# EAGLE board zx80 SD_12 (smd) build006.4 (STM32) (EAGLE 9.6.2), part 1 of 2
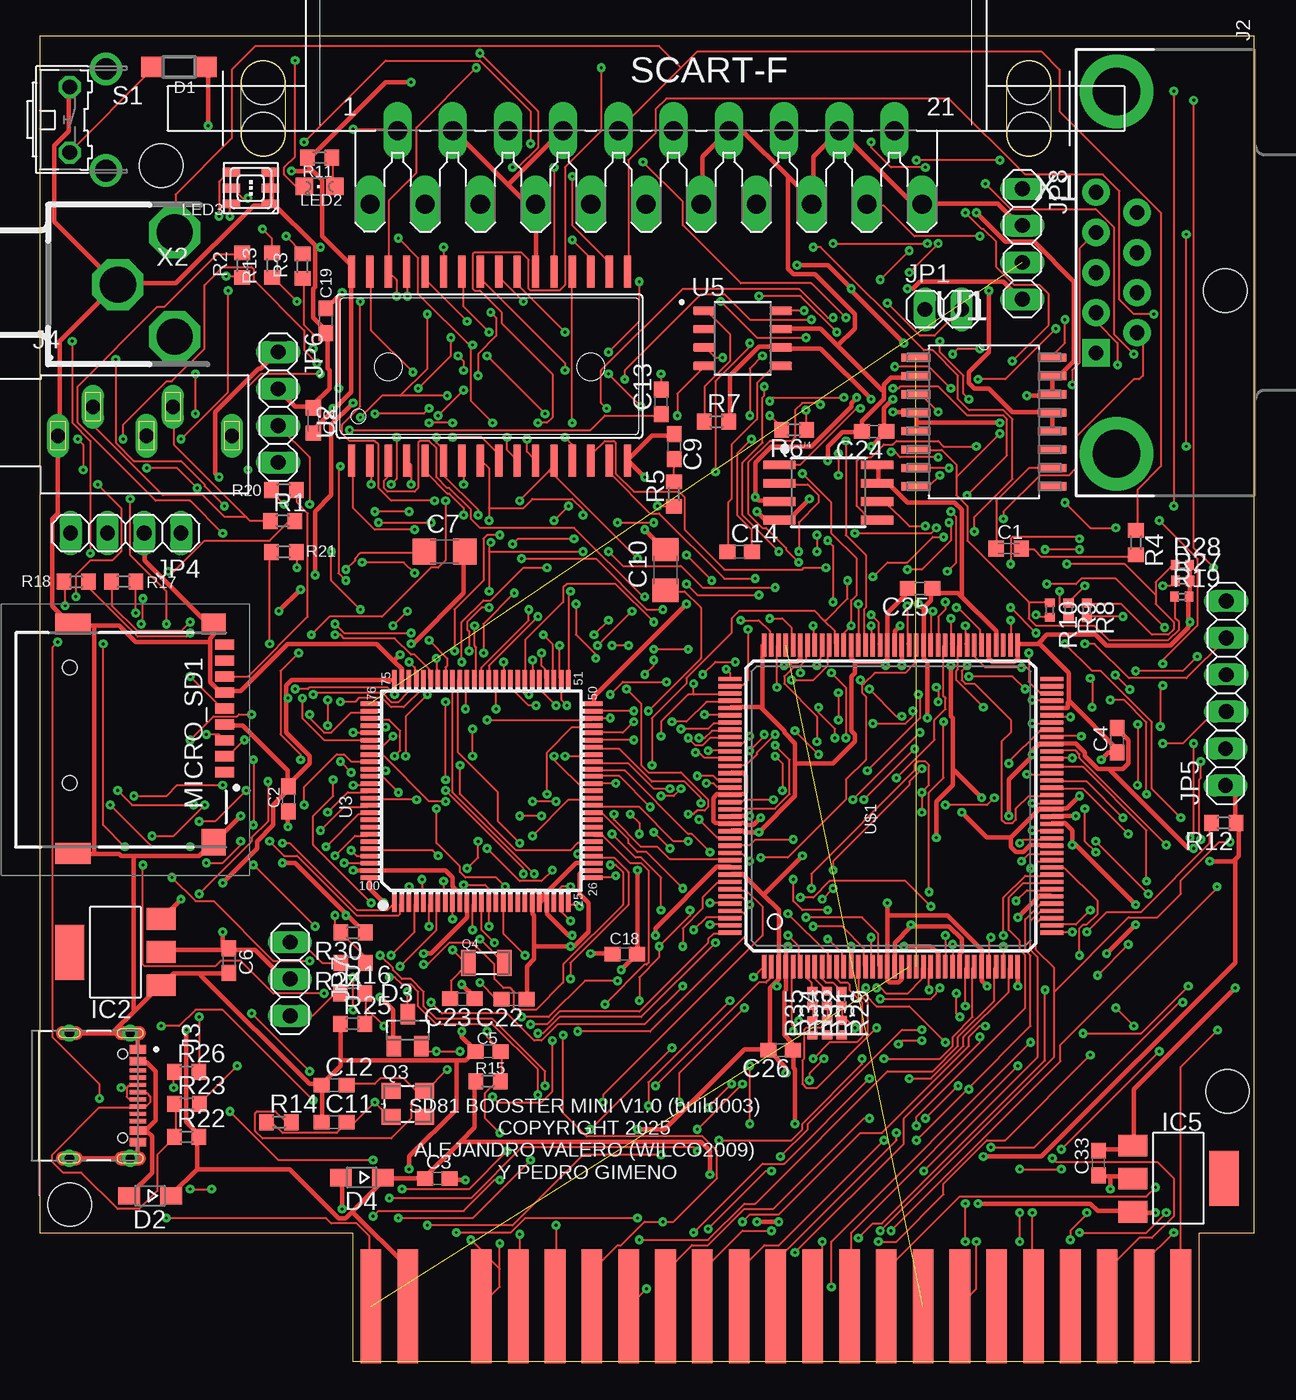
[diagram p3: board, top side]
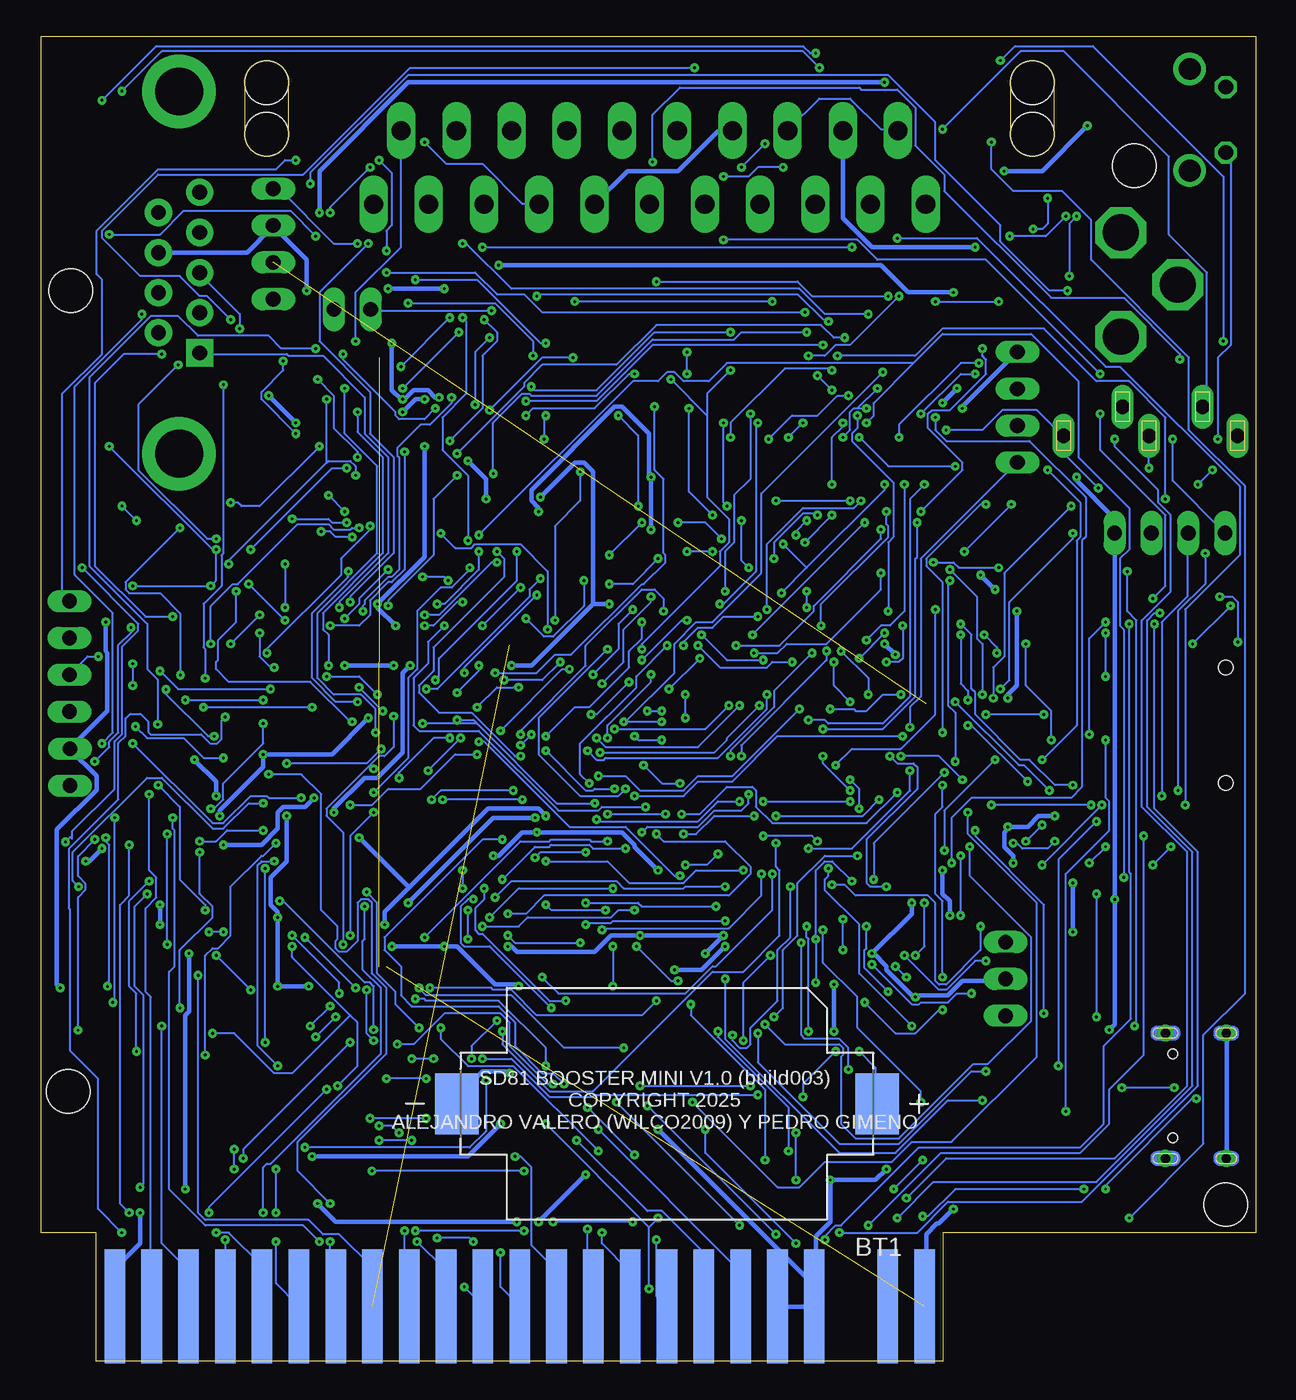
[diagram p4: board, bottom side, seen from below]

Size 83.82 x 91.44 mm. Coordinates in mm from the lower left corner, seen from the top.
Outline: 80.01,8.89 83.82,8.89 83.82,91.44 0,91.44 0,8.89 21.59,8.89 21.59,0 80.01,0 80.01,8.89
Copper layers (1*16): Top 0.035mm / dielectric 1.5mm / Bottom 0.035mm
Design rules "default *": minimum track width 5mil, minimum drill 0.2mm, track to track 5mil, track to pad 5mil, pad to pad 5mil, via to via 5mil, smd to smd 5mil, copper to edge 20mil, drill to drill 6mil, minimum pad ring 10mil, minimum via ring 8mil, stop-mask expansion 4mil, vias tented up to drill 999mil, thermal gap 10mil
Net classes: 1 VCC: width 0.3 mm; 2 3,3: width 0.3 mm
Holes 3 mm at 2.09,10.82 8.38,82.51 81.79,73.87 81.96,18.64

## Footprints (pad centres in the part's own frame; a part is rotated, then mirrored left to right if it is on the bottom)
EDGEPIN = smd 1.422 x 7.874: 1 0,0
BAT_CR2032-BS-6-1 = smd 3 x 4.2: N 14.5,0; P -14.5,0
C0603K = smd 1.05 x 1.08: 1 -0.875,0; 2 0.875,0
C0603 = smd 1.1 x 1: 1 -0.85,0; 2 0.85,0
C1206 = smd 1.6 x 1.8: 1 -1.4,0; 2 1.4,0
SOD123 = smd 1.4 x 1.4: A 1.9,0; C -1.9,0
SOD323-W = smd 1.5 x 1.2: A 1.45,0; C -1.45,0
SOT23 = smd 1 x 1.4: 1 -0.95,-1.1; 2 0.95,-1.1; 3 0,1.1
SOT223 = smd 1.499 x 2.007: 1 -2.261,-3.15; 2 0.025,-3.15; 3 2.311,-3.15 | smd 3.81 x 2.007: 4 0,3.15
DB9_MALE = drill 1.016 pad 1.88 square: 1 5.54,-1.42 | drill 1.016 pad 1.88: 2 2.77,-1.42; 3 0,-1.42; 4 -2.77,-1.42; 5 -5.54,-1.42; 6 4.15,1.42; 7 1.38,1.42; 8 -1.38,1.42; 9 -4.15,1.42 | drill 3.302 pad 5.08: G1 -12.5,0; G2 12.5,0
SHOUHAN_TYPE-C_16PIN_2MD__073_ = smd 0.6 x 1.14: A1_B12 -3.2,3.675; A4_B9 -2.4,3.675; B1_A12 3.2,3.675; B4_A9 2.4,3.675 | smd 0.3 x 1.14: A5 -1.25,3.675; A6 -0.25,3.675; A7 0.25,3.675; A8 1.25,3.675; B5 1.75,3.675; B6 0.75,3.675; B7 -0.75,3.675; B8 -1.75,3.675 | drill 0.65 pad 0.95: SH1 -4.325,3.125; SH2 4.325,3.125; SH3 -4.325,-1.075; SH4 4.325,-1.075 | hole 0.65: -2.89,2.605; 2.89,2.605
XKB_PJ-325C5-G = drill 1 long: 1 0,-0.9; 2 2.4,1.1; 3 7.92,1.1; 4 12,-0.9; 5 6.1,-0.9
1X02 = drill 1.016 long: 1 -1.27,0; 2 1.27,0
1X04 = drill 1.016 long: 1 -3.81,0; 2 -1.27,0; 3 1.27,0; 4 3.81,0
1X03 = drill 1.016 long: 1 -2.54,0; 2 0,0; 3 2.54,0
CHIPLED_0805 = smd 1.2 x 1.2: A 0,-1.05; C 0,1.05
3535-PLCC6 = smd 1.2 x 0.6: P1 1.35,-1.1; P2 1.35,0; P3 1.35,1.1; P4 -1.35,1.1; P5 -1.35,0; P6 -1.35,-1.1
TF-01A = smd 0.7 x 1.3: 1 2.23,7.174; 2 1.13,7.174; 3 0.03,7.174; 4 -1.07,7.174; 5 -2.17,7.174; 6 -3.27,7.174; 7 -4.37,7.174; 8 -5.47,7.174; CD1 -6.57,7.174 | smd 1.448 x 1.651: MP1 -7.989,6.4 | smd 1.448 x 2.438: MP2 -7.989,-3.3; MP3 7.836,-3.3 | smd 1.854 x 1.651: MP4 7.061,6.4 | hole 1: -5.004,-3.531; 2.972,-3.531
3.2X2.5_KX-7 = smd 1.3 x 1.1: 1 -1.15,-0.9; 2 1.15,-0.9; 3 1.15,0.9; 4 -1.15,0.9
3.2X1.5 = smd 1 x 1.8: 1 -1.25,0; 2 1.25,0
R0603 = smd 1 x 1.1: 1 -0.85,0; 2 0.85,0
R0402 = smd 0.6 x 0.7: 1 -0.5,0; 2 0.5,0
B3F-31XX = drill 1.016 octagon: 1 -2.261,-1.245; 2 2.261,-1.245 | drill 1.499 pad 2.159: 3 -3.505,1.245; 4 3.505,1.245
SOIC127P1032X265-16N = smd 1.981 x 0.559: 1 -4.699,4.445; 2 -4.699,3.175; 3 -4.699,1.905; 4 -4.699,0.635; 5 -4.699,-0.635; 6 -4.699,-1.905; 7 -4.699,-3.175; 8 -4.699,-4.445; 9 4.699,-4.445; 10 4.699,-3.175; 11 4.699,-1.905; 12 4.699,-0.635; 13 4.699,0.635; 14 4.699,1.905; 15 4.699,3.175; 16 4.699,4.445
SOP32-5 = smd 2.2 x 0.5: 1 -6.516,9.525; 2 -6.516,8.255; 3 -6.516,6.985; 4 -6.516,5.715; 5 -6.516,4.445; 6 -6.516,3.175; 7 -6.516,1.905; 8 -6.516,0.635; 9 -6.516,-0.635; 10 -6.516,-1.905; 11 -6.516,-3.175; 12 -6.516,-4.445; 13 -6.516,-5.715; 14 -6.516,-6.985; 15 -6.516,-8.255; 16 -6.516,-9.525; 17 6.516,-9.525; 18 6.516,-8.255; 19 6.516,-6.985; 20 6.516,-5.715; 21 6.516,-4.445; 22 6.516,-3.175; 23 6.516,-1.905; 24 6.516,-0.635; 25 6.516,0.635; 26 6.516,1.905; 27 6.516,3.175; 28 6.516,4.445; 29 6.516,5.715; 30 6.516,6.985; 31 6.516,8.255; 32 6.516,9.525
LQFP100-0.5-13.8X13.8MM = smd 1.2 x 0.32: 1 -7.75,6; 2 -7.75,5.5; 3 -7.75,5; 4 -7.75,4.5; 5 -7.75,4; 6 -7.75,3.5; 7 -7.75,3; 8 -7.75,2.5; 9 -7.75,2; 10 -7.75,1.5; 11 -7.75,1; 12 -7.75,0.5; 13 -7.75,0; 14 -7.75,-0.5; 15 -7.75,-1; 16 -7.75,-1.5; 17 -7.75,-2; 18 -7.75,-2.5; 19 -7.75,-3; 20 -7.75,-3.5; 21 -7.75,-4; 22 -7.75,-4.5; 23 -7.75,-5; 24 -7.75,-5.5; 25 -7.75,-6; 51 7.75,-6; 52 7.75,-5.5; 53 7.75,-5; 54 7.75,-4.5; 55 7.75,-4; 56 7.75,-3.5; 57 7.75,-3; 58 7.75,-2.5; 59 7.75,-2; 60 7.75,-1.5; 61 7.75,-1; 62 7.75,-0.5; 63 7.75,0; 64 7.75,0.5; 65 7.75,1; 66 7.75,1.5; 67 7.75,2; 68 7.75,2.5; 69 7.75,3; 70 7.75,3.5; 71 7.75,4; 72 7.75,4.5; 73 7.75,5; 74 7.75,5.5; 75 7.75,6 | smd 0.32 x 1.2: 26 -6,-7.75; 27 -5.5,-7.75; 28 -5,-7.75; 29 -4.5,-7.75; 30 -4,-7.75; 31 -3.5,-7.75; 32 -3,-7.75; 33 -2.5,-7.75; 34 -2,-7.75; 35 -1.5,-7.75; 36 -1,-7.75; 37 -0.5,-7.75; 38 0,-7.75; 39 0.5,-7.75; 40 1,-7.75; 41 1.5,-7.75; 42 2,-7.75; 43 2.5,-7.75; 44 3,-7.75; 45 3.5,-7.75; 46 4,-7.75; 47 4.5,-7.75; 48 5,-7.75; 49 5.5,-7.75; 50 6,-7.75; 76 6,7.75; 77 5.5,7.75; 78 5,7.75; 79 4.5,7.75; 80 4,7.75; 81 3.5,7.75; 82 3,7.75; 83 2.5,7.75; 84 2,7.75; 85 1.5,7.75; 86 1,7.75; 87 0.5,7.75; 88 0,7.75; 89 -0.5,7.75; 90 -1,7.75; 91 -1.5,7.75; 92 -2,7.75; 93 -2.5,7.75; 94 -3,7.75; 95 -3.5,7.75; 96 -4,7.75; 97 -4.5,7.75; 98 -5,7.75; 99 -5.5,7.75; 100 -6,7.75
SO08-EIAJ = smd 0.61 x 2.21: 1 -1.905,-3.378; 2 -0.635,-3.378; 3 0.635,-3.378; 4 1.905,-3.378; 5 1.905,3.353; 6 0.635,3.353; 7 -0.635,3.353; 8 -1.905,3.353
SOIC127P600X170-8N = smd 1.58 x 0.59: 1 -2.625,1.905; 2 -2.625,0.635; 3 -2.625,-0.635; 4 -2.625,-1.905; 5 2.625,-1.905; 6 2.625,-0.635; 7 2.625,0.635; 8 2.625,1.905
TQ144 = smd 1.6 x 0.3: P1 -11.1,8.75; P2 -11.1,8.25; P3 -11.1,7.75; P4 -11.1,7.25; P5 -11.1,6.75; P6 -11.1,6.25; P7 -11.1,5.75; P8 -11.1,5.25; P9 -11.1,4.75; P10 -11.1,4.25; P11 -11.1,3.75; P12 -11.1,3.25; P13 -11.1,2.75; P14 -11.1,2.25; P15 -11.1,1.75; P16 -11.1,1.25; P17 -11.1,0.75; P18 -11.1,0.25; P19 -11.1,-0.25; P20 -11.1,-0.75; P21 -11.1,-1.25; P22 -11.1,-1.75; P23 -11.1,-2.25; P24 -11.1,-2.75; P25 -11.1,-3.25; P26 -11.1,-3.75; P27 -11.1,-4.25; P28 -11.1,-4.75; P29 -11.1,-5.25; P30 -11.1,-5.75; P31 -11.1,-6.25; P32 -11.1,-6.75; P33 -11.1,-7.25; P34 -11.1,-7.75; P35 -11.1,-8.25; P36 -11.1,-8.75; P73 11.1,-8.75; P74 11.1,-8.25; P75 11.1,-7.75; P76 11.1,-7.25; P77 11.1,-6.75; P78 11.1,-6.25; P79 11.1,-5.75; P80 11.1,-5.25; P81 11.1,-4.75; P82 11.1,-4.25; P83 11.1,-3.75; P84 11.1,-3.25; P85 11.1,-2.75; P86 11.1,-2.25; P87 11.1,-1.75; P88 11.1,-1.25; P89 11.1,-0.75; P90 11.1,-0.25; P91 11.1,0.25; P92 11.1,0.75; P93 11.1,1.25; P94 11.1,1.75; P95 11.1,2.25; P96 11.1,2.75; P97 11.1,3.25; P98 11.1,3.75; P99 11.1,4.25; P100 11.1,4.75; P101 11.1,5.25; P102 11.1,5.75; P103 11.1,6.25; P104 11.1,6.75; P105 11.1,7.25; P106 11.1,7.75; P107 11.1,8.25; P108 11.1,8.75 | smd 0.3 x 1.6: P37 -8.75,-11.1; P38 -8.25,-11.1; P39 -7.75,-11.1; P40 -7.25,-11.1; P41 -6.75,-11.1; P42 -6.25,-11.1; P43 -5.75,-11.1; P44 -5.25,-11.1; P45 -4.75,-11.1; P46 -4.25,-11.1; P47 -3.75,-11.1; P48 -3.25,-11.1; P49 -2.75,-11.1; P50 -2.25,-11.1; P51 -1.75,-11.1; P52 -1.25,-11.1; P53 -0.75,-11.1; P54 -0.25,-11.1; P55 0.25,-11.1; P56 0.75,-11.1; P57 1.25,-11.1; P58 1.75,-11.1; P59 2.25,-11.1; P60 2.75,-11.1; P61 3.25,-11.1; P62 3.75,-11.1; P63 4.25,-11.1; P64 4.75,-11.1; P65 5.25,-11.1; P66 5.75,-11.1; P67 6.25,-11.1; P68 6.75,-11.1; P69 7.25,-11.1; P70 7.75,-11.1; P71 8.25,-11.1; P72 8.75,-11.1; P109 8.75,11.1; P110 8.25,11.1; P111 7.75,11.1; P112 7.25,11.1; P113 6.75,11.1; P114 6.25,11.1; P115 5.75,11.1; P116 5.25,11.1; P117 4.75,11.1; P118 4.25,11.1; P119 3.75,11.1; P120 3.25,11.1; P121 2.75,11.1; P122 2.25,11.1; P123 1.75,11.1; P124 1.25,11.1; P125 0.75,11.1; P126 0.25,11.1; P127 -0.25,11.1; P128 -0.75,11.1; P129 -1.25,11.1; P130 -1.75,11.1; P131 -2.25,11.1; P132 -2.75,11.1; P133 -3.25,11.1; P134 -3.75,11.1; P135 -4.25,11.1; P136 -4.75,11.1; P137 -5.25,11.1; P138 -5.75,11.1; P139 -6.25,11.1; P140 -6.75,11.1; P141 -7.25,11.1; P142 -7.75,11.1; P143 -8.25,11.1; P144 -8.75,11.1
SCART-F = drill 1.321 long: 1 19.05,5.08; 2 17.145,0; 3 15.24,5.08; 4 13.335,0; 5 11.43,5.08; 6 9.525,0; 7 7.62,5.08; 8 5.715,0; 9 3.81,5.08; 10 1.905,0; 11 0,5.08; 12 -1.905,0; 13 -3.81,5.08; 14 -5.715,0; 15 -7.62,5.08; 16 -9.525,0; 17 -11.43,5.08; 18 -13.335,0; 19 -15.24,5.08; 20 -17.145,0; 21 -19.05,5.08 | hole 3.023: 26.416,0.254; 26.416,-3.302; -26.416,0.254; -26.416,-3.302
3P = drill 2.5 pad 3.302 octagon: 1 -0.11,0; 2 3.81,3.595; 2@2 3.81,-3.595

## Placement (x,y rotation side)
1A  D7  [EDGEPIN]  22.86,3.81 0 top
1B  VCC  [EDGEPIN]  22.86,3.81 180 bottom
2A  /RAMCS  [EDGEPIN]  25.4,3.81 0 top
2B  9V  [EDGEPIN]  25.4,3.81 180 bottom
4A  D0  [EDGEPIN]  30.48,3.81 0 top
4B  GND  [EDGEPIN]  30.48,3.81 180 bottom
5A  D1  [EDGEPIN]  33.02,3.81 0 top
5B  GND  [EDGEPIN]  33.02,3.81 180 bottom
6A  D2  [EDGEPIN]  35.56,3.81 0 top
6B  /CLOCK  [EDGEPIN]  35.56,3.81 180 bottom
7A  D6  [EDGEPIN]  38.1,3.81 0 top
7B  A0  [EDGEPIN]  38.1,3.81 180 bottom
8A  D5  [EDGEPIN]  40.64,3.81 0 top
8B  A1  [EDGEPIN]  40.64,3.81 180 bottom
9A  D3  [EDGEPIN]  43.18,3.81 0 top
9B  A2  [EDGEPIN]  43.18,3.81 180 bottom
10A  D4  [EDGEPIN]  45.72,3.81 0 top
10B  A3  [EDGEPIN]  45.72,3.81 180 bottom
11A  A6  [EDGEPIN]  48.26,3.81 0 top
11B  A15  [EDGEPIN]  48.26,3.81 180 bottom
12A  /NMI  [EDGEPIN]  50.8,3.81 0 top
12B  A14  [EDGEPIN]  50.8,3.81 180 bottom
13A  /HALT  [EDGEPIN]  53.34,3.81 0 top
13B  A13  [EDGEPIN]  53.34,3.81 180 bottom
14A  /MREQ  [EDGEPIN]  55.88,3.81 0 top
14B  A12  [EDGEPIN]  55.88,3.81 180 bottom
15A  /IORQ  [EDGEPIN]  58.42,3.81 0 top
15B  A11  [EDGEPIN]  58.42,3.81 180 bottom
16A  /RD  [EDGEPIN]  60.96,3.81 0 top
16B  A10  [EDGEPIN]  60.96,3.81 180 bottom
17A  /WR  [EDGEPIN]  63.5,3.81 0 top
17B  A9  [EDGEPIN]  63.5,3.81 180 bottom
18A  /BUSAK  [EDGEPIN]  66.04,3.81 0 top
18B  A8  [EDGEPIN]  66.04,3.81 180 bottom
19A  /WAIT  [EDGEPIN]  68.58,3.81 0 top
19B  A7  [EDGEPIN]  68.58,3.81 180 bottom
20A  /BUSRQ  [EDGEPIN]  71.12,3.81 0 top
20B  A6  [EDGEPIN]  71.12,3.81 180 bottom
21A  /RESET  [EDGEPIN]  73.66,3.81 0 top
21B  A5  [EDGEPIN]  73.66,3.81 180 bottom
22A  /M1  [EDGEPIN]  76.2,3.81 0 top
22B  A4  [EDGEPIN]  76.2,3.81 180 bottom
23A  /RFSH  [EDGEPIN]  78.74,3.81 0 top
23B  /ROMCS  [EDGEPIN]  78.74,3.81 180 bottom
BT1  CR2032-BS-6-1  [BAT_CR2032-BS-6-1]  40.64,17.78 180 bottom
C1  220uF  [C0603K]  66.87,56.09 0 top
C2  100nF  [C0603]  17.17,38.81 270 top
C3  10uF  [C0603]  27.45,12.63 0 top
C4  100nF  [C0603]  74.34,42.86 90 top
C5  22pF  [C0603]  30.94,21.39 0 top
C6  10uF  [C0603]  13.07,27.66 270 top
C7  10uF  [C1206]  27.94,55.88 0 top
C8  100nF  [C0603K]  18.88,64.92 270 top
C9  1uF  [C0603]  43.78,63.12 270 top
C10  10uF  [C1206]  43.18,54.61 90 top
C11  22pF  [C0603]  20.32,16.51 0 top
C12  22pF  [C0603]  20.32,19.05 0 top
C13  1uF  [C0603]  42.87,66.22 90 top
C14  470uF  [C0603]  48.3,55.86 0 top
C18  100nF  [C0603]  40.37,28.11 0 top
C19  100nF  [C0603]  19.75,71.81 270 top
C22  22pF  [C0603]  32.73,25 180 top
C23  22pF  [C0603]  29.16,25.02 180 top
C24  0.1uF  [C0603]  57.58,64.17 180 top
C25  0.1uF  [C0603]  60.76,53.34 180 top
C26  100nF  [C0603]  51.13,21.49 180 top
C33  10uF  [C0603]  73.05,13.7 90 top
D1  1n4148  [SOD123]  9.62,89.32 180 top
D2  1n5819  [SOD323-W]  7.62,11.43 180 top
D3  BAT54C  [SOT23]  25.4,22.86 0 top
D4  1n5819  [SOD323-W]  22.23,12.7 180 top
IC2  REG1117  [SOT223]  5.23,28.23 90 top
IC5  1.2V  [SOT223]  78.57,12.64 270 top
J2  JOYSTICK  [DB9_MALE]  74.31,75.13 270 top
J3  TYPE-C_16PIN_2MD__073_  [SHOUHAN_TYPE-C_16PIN_2MD__073_]  3.12,18.33 270 top
J4  PJ-325C5-G  [XKB_PJ-325C5-G]  1.27,64.77 0 top
JP1  SPEAKER  [1X02]  62.35,72.6 0 top
JP3  JTAG  [1X04]  81.88,48.65 90 top
JP4  SERIAL  [1X04]  5.94,57.16 180 top
JP5  VREF  [1X02]  81.83,41.01 90 top
JP6  PS2  [1X04]  16.46,65.84 270 top
JP7  BOOT  [1X03]  17.28,26.39 270 top
JP8  ST-LINK-V2  [1X04]  67.81,77.11 270 top
LED2  SD  [CHIPLED_0805]  19.33,81.06 90 top
LED3  STATUS  [3535-PLCC6]  14.57,80.96 0 top
MICRO_SD1  TF-01A  [TF-01A]  5.6,42.89 270 top
Q3  8MHz  [3.2X2.5_KX-7]  25.4,17.78 0 top
Q4  32767Hz  [3.2X1.5]  30.82,27.49 0 top
R1  300R  [R0603]  16.75,58 0 top
R2  150  [R0603]  13.98,75.64 270 top
R3  68  [R0603]  18.13,75.59 90 top
R4  75R  [R0603]  75.64,56.51 270 top
R5  100R  [R0603]  43.76,59.86 90 top
R6  100R  [R0603]  52.06,64.28 180 top
R7  10K  [R0603]  46.71,64.84 0 top
R8  270  [R0402]  72.25,51.84 270 top
R9  270  [R0402]  71,51.83 270 top
R10  270  [R0402]  69.69,51.85 270 top
R11  680  [R0603]  19.31,83.06 0 top
R12  2K  [R0603]  81.71,37.16 180 top
R13  150  [R0603]  16.05,75.63 90 top
R14  1M  [R0603]  16.51,16.51 0 top
R15  3K3  [R0603]  30.94,19.34 180 top
R16  510  [R0603]  21.59,25.4 0 top
R17  3k3  [R0603]  5.79,53.81 180 top
R18  3k3  [R0603]  2.52,53.8 0 top
R19  75R  [R0402]  78.82,52.77 0 top
R20  3k3  [R0603]  16.85,60.14 0 top
R21  3k3  [R0603]  16.85,55.86 180 top
R22  1K5  [R0603]  10.14,15.5 0 top
R23  22R  [R0603]  10.16,17.78 0 top
R24  510  [R0603]  21.63,27.51 180 top
R25  10K  [R0603]  21.6,23.3 0 top
R26  22R  [R0603]  10.13,19.98 0 top
R27  75R  [R0402]  78.87,53.87 0 top
R28  75R  [R0402]  78.85,54.94 0 top
R29  1K  [R0402]  55.32,25.04 270 top
R30  10K  [R0603]  21.63,29.59 180 top
R31  1K  [R0402]  54.32,25.04 270 top
R32  1K  [R0402]  53.32,25.04 270 top
R33  2K  [R0402]  55.34,23.03 90 top
R34  2K  [R0402]  54.34,23.03 90 top
R35  2K  [R0402]  53.33,23.01 90 top
S1  RESET  [B3F-31XX]  3.32,85.67 270 top
U1  AD724JRZ  [SOIC127P1032X265-16N]  65.16,64.83 0 top
U2  AS6C4008  [SOP32-5]  31.04,68.68 90 top
U3  MCU-STM32F407VET6(LQFP100)  [LQFP100-0.5-13.8X13.8MM]  30.48,39.37 90 top
U4  25F32006WSOI  [SO08-EIAJ]  54.44,59.96 270 top
U5  PAM8302AADCR  [SOIC127P600X170-8N]  48.5,70.59 0 top
U$1  XC6SLX9-2TQG144C  [TQ144]  58.74,38.34 90 top
X1  SCART-F  [SCART-F]  41.84,84.93 180 top
X2  CON-CONRAD_736880-2P  [3P]  5.51,74.3 0 top

## Tracks (layer width: path | path; a pad name or v marks a point on that pad's centre or on a via)
1V2  (via drill 0.2)
  Top 0.3: 73.88,12.77 75.25,12.77 75.38,12.64 IC5.2 | 73.88,12.77 73.12,12.77 C33.1 | 60.12,30.02 59,28.89 59,27.27 U$1.P19 | 60.12,30.02 62.75,30.02 63.62,29.14 63.62,28.27 63.5,28.14 63.5,27.27 U$1.P28 | v49,37.64 47.75,37.64 U$1.P128 | v60.12,30.14 60.12,30.02 | v59.5,48.02 59.5,49.39 U$1.P89 | v62.88,48.02 62.88,44.52 63,44.39 63,40.77 | 63,40.77 63,39.77 61.88,38.64 v61.88,36.14 | v65,38.89 63.12,40.77 63,40.77 | U$1.P52 69.88,37.14 70.75,37.14 71.25,36.64 v71.25,35.64 71.38,35.77 v75.62,31.52 | v73.88,11.89 73.88,12.77 | v75.62,30.14 v73.62,28.14
  Bottom 0.3: v49,37.64 49.5,38.14 53,38.14 58.44,32.7 | 58.44,32.7 60.12,31.02 v60.12,30.14 | v62.88,48.02 v59.5,48.02 | 58.44,32.7 v61.88,36.14 | v71.25,35.64 68.62,35.64 67.5,36.77 67.5,37.89 67.12,38.27 65.62,38.27 v65,38.89 | v73.88,11.89 73.88,23.89 73.62,24.14 v73.62,28.14 | v75.62,31.52 v75.62,30.14
3V3  (via drill 0.2)
  Top 0.3: U$1.P122 47.75,40.64 48.5,40.64 48.75,40.39 48.75,39.27 48.62,39.14 47.75,39.14 U$1.P125 47.5,39.14 46.75,39.14 46.5,38.89 46.5,37.27 46.62,37.14 47.5,37.14 U$1.P129 47.75,37.14 48.62,37.14 48.75,37.02 49.25,37.02 v49.75,37.52 | U$1.P20 59.5,27.14 59.5,26.39 59.25,26.14 58.62,26.14 58.5,26.27 58.5,27.14 U$1.P18 58.5,27.39 58.5,30.77 | 58.5,30.77 v58.5,31.64 | 58.5,30.77 62.62,30.77 65,28.39 65,27.27 U$1.P31 65,27.14 65,26.27 v65.38,25.89 | v67.5,25.89 67.5,27.14 U$1.P36 | v67.5,30.64 69,32.14 69.75,32.14 U$1.P42 | v38,28.14 39.5,28.14 C18.1 | v36.75,29.39 36.5,29.39 35,30.89 35,31.52 U3.22 35,31.77 34.81,31.95 | 34.81,31.95 34.69,32.08 | 34.69,32.08 34.25,32.52 33.62,32.52 33.5,32.39 33.5,31.64 U3.19 | 34.81,31.95 U3.21 | 34.69,32.08 37,34.39 38.12,34.39 U3.28 | v42.5,29.39 42.5,29.89 46.75,34.14 47.62,34.14 U$1.P135 | v51.62,28.64 51.5,28.52 51.5,27.39 U$1.P4 51.5,27.14 51.5,25.64 51.38,25.52 51.38,22.52 51.88,22.02 51.88,21.52 C26.1 52,21.39 52,20.27 52.12,20.14 v52.12,16.39 | v44.62,52.27 38.25,45.89 38.25,45.39 U3.50 | v51.38,48.02 51.62,48.02 51.88,48.27 52.25,48.27 52.5,48.52 52.5,49.39 U$1.P103 | U4.3 51,59.39 49.62,59.39 v49.38,59.64 49.38,62.02 50.5,63.14 53.25,63.14 56,65.89 56,66.14 v56.38,66.52 | JP5.1 81.88,39.64 82.5,39.02 82.5,37.27 R12.1 82.75,36.97 82.75,34.88 82.43,34.56 | 73.88,40.89 73,40.89 72.12,41.77 72.12,42.02 71.5,42.64 69.88,42.64 U$1.P63 69.75,42.64 69,42.64 68.5,42.14 v68.5,41.89 68.5,41.77 66.88,40.14 v66.88,37.64 | 73.88,40.89 74.75,40.89 75.12,41.27 75.12,42.89 74.38,43.64 C4.2 | v71.5,37.64 69.88,37.64 U$1.P53
  Top 0.3: v80.75,34.52 82.5,34.52 82.5,27.52 69.12,14.14 v65.12,14.14 | v79.62,35.39 79.25,35.39 73.88,40.77 73.88,40.89 | U4.8 57.88,61.77 57.88,60.64 U4.7 58,60.64 58.5,60.64 59.88,59.27 63.12,59.27 63.62,58.77 63.62,52.89 63.56,52.83 | 61,52.02 61.5,52.52 61.5,53.27 C25.1 61.62,53.02 63.38,53.02 63.56,52.83 | 61,52.02 61,49.52 U$1.P86 61,49.39 61,48.52 61.25,48.27 v61.25,44.39 | v57.38,63.14 58.38,64.14 C24.1 58.25,64.14 58.25,65.77 v58.88,66.39 | v60.62,52.27 60.88,52.02 61,52.02 | v59.38,50.77 59,50.39 59,49.52 U$1.P90 | 63.56,52.83 66,50.39 66,49.52 U$1.P76 | C2.1 17.12,39.77 17.12,40.77 14,43.89 12.88,43.89 MICRO_SD1.4 | 17,45.77 17,43.39 18.62,41.77 18.62,41.27 17.25,39.89 C2.1 | 17,45.77 17,46.64 17.38,47.02 24.38,47.02 U3.75 | C6.1 13,28.39 8.62,28.39 8.5,28.27 IC2.2 | v26.5,28.14 27,28.14 29.5,30.64 29.5,31.52 U3.11 | v23.75,31.64 22.75,32.64 22.75,33.27 U3.100 | v23.5,25.14 24.38,24.27 24.38,21.77 D3.1 | C6.1 13.12,28.39 14.88,28.39 16.88,26.39 17.25,26.39 JP7.2 | v12.62,33.02 15,35.39 15,35.89 16.12,37.02 16.12,38.39 17.12,39.39 17.12,39.64 C2.1 | v12.62,29.64 12.62,28.52 C6.1 | v20.88,73.77 20.56,73.45 | 20.56,73.45 19.88,72.77 C19.1 | v52.25,75.64 54.38,75.64 v56,74.02 56,73.89 v59.62,70.27 | v59.88,74.02 60.25,74.02 60.75,74.52 66.5,74.52 67.75,73.27 JP8.4 | v18,53.27 v16.5,51.77 | v19,54.27 19,58.64 20.12,59.77 20.12,64.64 v21.62,66.14 | v20.62,67.14 20.62,73.39 20.56,73.45 | v17.12,45.77 17,45.77
  Bottom 0.3: v49.75,37.52 52.62,37.52 v58.5,31.64 | v65.38,25.89 v67.5,25.89 v67.5,30.64 67.5,31.02 68,31.52 68,33.39 66.88,34.52 v66.88,37.64 | v38,28.14 v36.75,29.39 v42.5,29.39 44.5,29.39 45.62,28.27 51,28.27 51.38,28.64 v51.62,28.64 | 45.75,52.27 v44.62,52.27 | 45.75,52.27 50,48.02 v51.38,48.02 | v49.38,59.64 47,62.02 46.38,62.02 45.75,61.39 45.75,52.27 | v71.5,37.64 71.5,38.02 68.5,41.02 v68.5,41.89 63.75,41.89 v61.25,44.39 | v80.75,34.52 80.5,34.52 v79.62,35.39 | v57.38,63.14 57.38,55.52 v60.62,52.27 60.62,52.02 v59.38,50.77 | v56.38,66.52 56.62,66.52 57.12,67.02 58.12,67.02 58.75,66.39 v58.88,66.39 59,66.39 59.62,67.02 v59.62,70.27 | v52.12,16.39 54.38,14.14 v65.12,14.14 | 23.5,25.27 21.25,25.27 20.25,26.27 17.38,26.27 JP7.2 | 23.5,25.27 23.75,25.27 25.5,27.02 25.5,27.27 26.38,28.14 v26.5,28.14 23.75,30.89 v23.75,31.64 | v23.5,25.14 23.5,25.27 | v12.62,29.64 v12.62,33.02 | v20.88,73.77 24,73.77 25.88,75.64 v52.25,75.64 | v59.88,74.02 v56,74.02 | v17.12,45.77 17.12,46.02 16.5,46.64 v16.5,51.77 | v19,54.27 v18,53.27 | v20.62,67.14 v21.62,66.14
/CLOCK  (via drill 0.2)
  Top 0.127: v61.38,25.64 61.38,27.14 U$1.P24 | v60.88,22.14 59.5,22.14 v59.25,21.89 | v45.38,16.02 v48.5,19.14
  Bottom 0.127: v61.38,25.64 61.38,22.64 v60.88,22.14 | v59.25,21.89 58.12,21.89 56,24.02 52.12,24.02 51.5,23.39 51.5,21.77 48.88,19.14 v48.5,19.14 | v45.38,16.02 35.62,6.27 35.62,3.89 6B.1
/HALT  (via drill 0.2)
  Top 0.127: v71.75,28.02 71.75,29.89 72,30.14 72.25,30.14 73,30.89 73,31.77 70.75,34.02 69.88,34.02 U$1.P46 | v69.38,25.64 69.38,20.77 58.12,9.52 57.5,9.52 v56.5,8.52 | v54,8.27 54,4.52 53.38,3.89 13A.1
  Bottom 0.127: v69.38,25.64 v71.75,28.02 | v56.5,8.52 54.25,8.52 v54,8.27
/IORQ  (via drill 0.2)
  Top 0.127: v68.5,36.64 69.75,36.64 U$1.P51 | v76.5,32.27 v72.88,35.89 | v77,12.02 76.38,11.39 63.5,11.39 58.5,6.39 58.5,3.89 15A.1
  Bottom 0.127: v68.5,36.64 71,36.64 71.75,35.89 v72.88,35.89 | v76.5,32.27 77.38,31.39 77.38,25.89 76.75,25.27 76.75,12.27 v77,12.02
/M1  (via drill 0.2)
  Top 0.127: 22A.1 76.2,6.83 v78.26,8.89 | v71.13,44.46 69.97,44.46 U$1.P67
  Bottom 0.127: v78.26,8.89 79.89,10.53 79.89,19.5 81.83,21.44 81.83,31.18 81.9,31.24 81.9,35.39 78.5,38.79 78.5,42.66 77.99,43.16 77.99,44.36 77.67,44.69 76.95,44.69 76.42,44.15 76.42,43.42 76.27,43.27 72.79,43.27 72.17,42.65 71.67,42.65 71.38,42.94 71.38,44.21 v71.13,44.46
/MEM_OE  (via drill 0.2)
  Top 0.127: v57.38,51.52 57.88,51.02 57.88,49.52 U$1.P92 | v52.38,55.14 51.5,56.02 51.5,56.14 50.12,57.52 49.88,57.52 48.88,58.52 48.88,62.02 50.38,63.52 51.88,63.52 52.12,63.77 52.12,65.64 52.62,66.14 53.75,66.14 v53.88,66.02 | v52.88,70.64 49.5,70.64 v47,73.14 | v33.38,73.14 31.75,74.77 31.75,75.14 U2.24
  Bottom 0.127: v57.38,51.52 56.38,51.52 52.75,55.14 v52.38,55.14 | v53.88,66.02 53.88,69.64 v52.88,70.64 | v33.38,73.14 v47,73.14
/MREQ  (via drill 0.2)
  Top 0.127: v67.75,34.52 68.25,35.02 69.75,35.02 U$1.P48 | v67.5,20.39 56,8.89 56,3.89 14A.1
  Bottom 0.127: v67.75,34.52 68.62,34.52 68.88,34.27 68.88,21.77 v67.5,20.39
/NMI  (via drill 0.2)
  Top 0.127: v60.5,16.27 60.5,16.89 68,24.39 68,28.02 67.62,28.39 67.62,29.02 66.88,29.77 66.88,32.02 67.88,33.02 69.75,33.02 U$1.P44 | v59.12,15.77 59.12,15.27 50.88,7.02 50.88,3.89 12A.1
  Bottom 0.127: v60.5,16.27 59.62,16.27 v59.12,15.77
/OE_OL  (via drill 0.2)
  Top 0.127: v35,39.14 35,42.02 36.75,43.77 38.12,43.77 U3.47 | v43.5,35.39 v42.38,36.52 | v52,33.27 52,31.77 52.62,31.14 v54.38,31.14 | v54.38,29.14 55.38,28.14 55.38,27.27 U$1.P12
  Bottom 0.127: v35,39.14 35,38.52 35.5,38.02 37.38,38.02 38.5,36.89 42,36.89 v42.38,36.52 | v43.5,35.39 45.75,35.39 46,35.64 48.62,35.64 48.75,35.52 49.75,35.52 v52,33.27 | v54.38,29.14 v54.38,31.14
/RD  (1 unrouted)
/RESET  (via drill 0.2)
  Top 0.127: v27.5,34.89 27.12,35.27 22.75,35.27 U3.96 | v33.25,23.77 35.12,23.77 37.62,26.27 v39.88,26.27 | v44.88,31.14 44.88,30.77 v42.75,28.64 42.75,27.89 41.38,26.52 v41.38,24.89 | v49,31.52 48.5,32.02 47.75,32.02 U$1.P139 | v69.88,14.02 70.12,13.77 77.12,13.77 78.25,12.64 78.25,10.02 76.75,8.52 75.88,8.52 73.75,6.39 73.75,3.89 21A.1 | v62.5,22.02 60,24.52 57.75,24.52 57,25.27 v57,25.77
  Bottom 0.127: v27.5,34.89 29.75,34.89 31.62,33.02 31.62,29.39 32.62,28.39 32.62,24.39 v33.25,23.77 | v39.88,26.27 40.38,26.27 v42.75,28.64 | v44.88,31.14 48.62,31.14 v49,31.52 | v69.88,14.02 69.88,14.64 v62.5,22.02 | v57,25.77 52.75,25.77 52.62,25.64 51.38,25.64 49.62,23.89 42.38,23.89 v41.38,24.89
/RFSH  (via drill 0.2)
  Top 0.127: v67,51.14 67,49.52 U$1.P74 | v69.5,53.64 71.5,53.64 71.88,54.02 74.25,54.02 v77.62,50.64 | v80.12,41.39 80.12,40.27 80,40.14 80,36.14 v80.12,36.02 | v81.28,22.86 78.75,20.33 78.75,3.89 23A.1
  Bottom 0.127: v69.5,53.64 v67,51.14 | v77.62,50.64 77.62,50.31 78.5,49.44 78.5,43.39 79.12,42.77 79.12,42.39 v80.12,41.39 | v80.12,36.02 81.28,34.86 81.28,33.49 80.75,32.96 80.75,32.55 81.28,32.02 v81.28,22.86
/WAIT  (via drill 0.2)
  Top 0.127: v36.62,32.77 36,32.77 35.5,32.27 35.5,31.64 U3.23 | v52.5,32.02 53.38,32.02 54.5,33.14 59.75,33.14 v61.5,31.39 | v68.5,10.27 68.5,3.89 19A.1
  Bottom 0.127: v36.62,32.77 39.38,32.77 39.5,32.64 43.62,32.64 44.12,33.14 51.38,33.14 v52.5,32.02 | v61.5,31.39 61.5,29.14 61.62,29.02 61.62,27.02 60.38,25.77 60.38,21.27 68,13.64 68.25,13.64 68.5,13.39 v68.5,10.27
/WR  (via drill 0.2)
  Top 0.127: v74.75,37.52 72.25,40.02 69.88,40.02 U$1.P58 | v64.62,8.27 64.62,5.02 63.5,3.89 17A.1
  Bottom 0.127: v74.75,37.52 74.75,36.77 74.62,36.64 74.62,27.27 75,26.89 75,11.89 72.5,9.39 65.75,9.39 v64.62,8.27
/WR'  (via drill 0.2)
  Top 0.127: v39.75,33.52 39.62,33.39 38.25,33.39 U3.26 | v53.62,42.77 53.62,44.52 51.38,46.77 51.38,47.27 52,47.89 52.38,47.89 52.5,48.02 | 52.5,48.02 52.88,48.39 52.88,49.39 U$1.P102 | v25.38,73.52 25.38,75.14 U2.29 | v41.38,74.52 41.38,71.77 v39.25,69.64 | v41.5,65.89 v39.25,68.14 | 52.5,48.02 v52.5,47.52
  Bottom 0.127: v39.75,33.52 40.12,33.52 43.5,36.89 47.38,36.89 53.25,42.77 v53.62,42.77 | v25.38,73.52 30.62,73.52 31.62,74.52 v41.38,74.52 | v39.25,68.14 v39.25,69.64 | v41.5,65.89 41.5,61.52 40.88,60.89 40.88,55.77 40.75,55.64 40.75,55.14 42.25,53.64 42.38,53.64 47.25,48.77 48.38,48.77 49.62,47.52 v52.5,47.52
A0  (via drill 0.2)
  Top 0.127: v58.25,20.89 62.12,20.89 63,21.77 63,22.39 64.38,23.77 64.38,27.14 U$1.P30 | v56.75,20.89 56.75,20.52 52.62,16.39 52.62,16.02 51.88,15.27 v46.88,15.27
  Bottom 0.127: v56.75,20.89 v58.25,20.89 | v46.88,15.27 42,10.39 41,10.39 38.12,7.52 38.12,3.89 7B.1
A0'  (via drill 0.2)
  Top 0.127: v21.5,35.27 21.88,34.89 22.62,34.89 U3.97 | v18,41.52 18,41.89 16.62,43.27 16.62,47.64 v17.88,48.89 | v18.75,50.14 20,51.39 23.62,51.39 27,54.77 27.5,54.77 28,55.27 v28,59.39 | 35.12,61.39 35.38,61.64 35.38,62.14 U2.12 | 35.12,61.39 v33.12,59.39 | v59.12,40.27 61.75,42.89 61.75,44.27 62.5,45.02 62.5,45.77 62.38,45.89 62.38,49.39 U$1.P83 | v55.62,43.02 55.62,46.52 v54.62,47.52 | v49.62,52.89 45.38,52.89 v44.62,53.64 | v41.25,55.39 35.25,61.39 35.12,61.39
  Bottom 0.127: v21.5,35.27 21.5,38.02 v18,41.52 | v17.88,48.89 17.88,49.27 v18.75,50.14 | v33.12,59.39 v28,59.39 | v59.12,40.27 59.12,40.64 56.75,43.02 v55.62,43.02 | v54.62,47.52 54.62,47.89 v49.62,52.89 | v44.62,53.64 43,53.64 v41.25,55.39
A1  (via drill 0.2)
  Top 0.127: v41.38,8.39 46.12,8.39 48.62,10.89 49.38,10.89 58.5,20.02 61.62,20.02 63.38,21.77 63.38,22.39 65.88,24.89 65.88,27.14 U$1.P33
  Bottom 0.127: v41.38,8.39 41.38,4.52 40.75,3.89 8B.1
A1'  (via drill 0.2)
  Top 0.127: v21,34.39 22.62,34.39 U3.98 | v22.12,65.14 23.62,66.64 24.88,66.64 | v28.12,66.64 24.88,66.64 | v33.62,63.64 33.62,62.77 34.12,62.27 U2.11 | v62.5,52.39 62.5,51.89 62,51.39 62,49.52 U$1.P84 | v54.75,77.14 v61.25,77.14 | v26.75,72.27 26.75,68.52 24.88,66.64
  Bottom 0.127: v21,34.39 21,37.52 19.62,38.89 12.75,38.89 12,39.64 12,56.64 11.75,56.89 11.75,59.64 15.62,63.52 21.38,63.52 22.12,64.27 v22.12,65.14 | v28.12,66.64 28.88,66.64 30.25,65.27 32,65.27 v33.62,63.64 | v62.5,52.39 62.5,52.77 59.5,55.77 59.5,62.39 61.12,64.02 61.12,66.89 64.62,70.39 64.62,73.77 v61.25,77.14 | v54.75,77.14 54.5,77.14 51.38,74.02 31.5,74.02 29.75,72.27 v26.75,72.27
A2  (via drill 0.2)
  Top 0.127: v60,19.52 61.5,19.52 63.75,21.77 63.75,22.39 66.88,25.52 66.88,27.14 U$1.P35 | v57.25,19.52 51.38,13.64 49.88,13.64 v45.12,8.89
  Bottom 0.127: v57.25,19.52 v60,19.52 | v45.12,8.89 45.12,8.14 43.25,6.27 43.25,3.89 9B.1
A2'  (via drill 0.2)
  Top 0.127: U3.1 24,31.14 21.88,31.14 17.25,35.77 v16.75,35.77 | v13.88,35.89 13.88,35.64 12.62,34.39 v11.5,34.39 | v10.38,35.52 7.75,35.52 v4.88,38.39 | v24.75,77.52 26.12,76.14 26.12,73.64 29.75,70.02 | 29.75,70.02 29.75,66.27 v31.25,64.77 | v32.25,63.77 32.25,62.89 32.88,62.27 U2.10 | v61.62,51.77 61.5,51.64 61.5,49.52 U$1.P85 | v55.5,66.52 50.62,66.52 v50.38,66.27 | 29.75,70.02 v29.88,70.14
  Bottom 0.127: v16.75,35.77 16.5,35.77 16.12,35.39 14.38,35.39 v13.88,35.89 | v10.38,35.52 v11.5,34.39 | v4.88,38.39 4.88,51.89 1.12,55.64 1.12,60.39 9.38,68.64 10.38,68.64 19.25,77.52 v24.75,77.52 | v32.25,63.77 v31.25,64.77 | v61.62,51.77 61.62,52.14 61.5,52.27 61.5,52.52 59.88,54.14 59.62,54.14 59.12,54.64 59.12,62.39 59.25,62.52 59.25,63.02 57.62,64.64 57,64.64 55.5,66.14 v55.5,66.52 | v50.38,66.27 45.5,66.27 41.62,70.14 v29.88,70.14
A3  (via drill 0.2)
  Top 0.127: v61,13.14 68.88,21.02 68.88,27.89 68.38,28.39 68.38,30.39 69,31.02 69.75,31.02 U$1.P40 | v50.5,13.14 50.12,13.14 v46.12,9.14
  Bottom 0.127: v50.5,13.14 v61,13.14 | v46.12,9.14 46.12,4.27 45.75,3.89 10B.1
A3'  (via drill 0.2)
  Top 0.127: v15.88,35.89 16.88,34.89 17.75,34.89 21.88,30.77 24.75,30.77 24.88,30.89 24.88,31.52 U3.2 | v14.75,41.52 v14.75,37.02 | v14.38,61.52 14.38,67.27 15.25,68.14 v19.38,68.14 | v23.12,65.39 26.5,65.39 v26.88,65.77 | v28.5,63.77 30.5,63.77 31.62,62.64 31.62,62.27 U2.9 | v59.88,52.14 59.88,49.52 U$1.P88 | v55.12,62.64 v55.12,61.14 | v28.38,70.64 28.38,69.39 v26.12,67.14
  Bottom 0.127: v14.75,37.02 v15.88,35.89 | v14.75,41.52 12.38,43.89 12.38,56.64 12.12,56.89 12.12,59.27 v14.38,61.52 | v19.38,68.14 20.38,68.14 v23.12,65.39 | 27.5,65.77 27.75,65.77 28,65.52 28,64.27 v28.5,63.77 | 27.5,65.77 v26.88,65.77 | v59.88,52.14 59.88,52.52 56.75,55.64 56.75,59.52 v55.12,61.14 | v55.12,62.64 50.5,67.27 50.5,67.52 49.25,68.77 44.12,68.77 41.38,71.52 30,71.52 29.12,70.64 v28.38,70.64 | 27.5,65.77 v26.12,67.14
A4  (via drill 0.2)
  Top 0.127: v68.5,45.64 69.75,45.64 U$1.P69 | v73.88,45.64 74.83,45.64 76.38,44.1 v76.38,39.14
  Bottom 0.127: v73.88,45.64 v68.5,45.64 | v76.38,39.14 76.38,33.89 75.88,33.39 75.88,32.02 76.62,31.27 76.62,25.52 76.25,25.14 76.25,3.89 22B.1
A4'  (via drill 0.2)
  Top 0.127: v25.5,32.77 25.5,31.64 U3.3 | v25.25,41.77 25.25,44.52 v26.75,46.02 | v28.62,49.02 28.62,51.89 30.62,53.89 30.62,56.77 30.88,57.02 v31.75,57.02 | 31,58.89 31,61.64 30.5,62.14 U2.8 | 31,58.89 v31,58.02 | v57.38,50.77 57.38,49.52 U$1.P93 | v54.75,52.39 54.75,56.27 v54.38,56.64 | v54.75,72.02 54.38,72.02 52.38,74.02 44.38,74.02 38.75,68.39 38.75,66.14 v39.12,65.77 | v37.5,58.39 37.5,58.77 36.75,59.52 34,59.52 33.38,58.89 31,58.89
  Bottom 0.127: v25.5,32.77 26.62,32.77 26.88,33.02 26.88,36.02 23.38,39.52 23.38,41.02 23.62,41.27 24.75,41.27 v25.25,41.77 | v26.75,46.02 26.75,47.14 v28.62,49.02 | v31.75,57.02 31.75,57.27 v31,58.02 | v57.38,50.77 56.75,50.77 55.12,52.39 v54.75,52.39 | v54.38,56.64 54.38,61.14 56.12,62.89 56.12,65.14 54.5,66.77 54.5,71.77 v54.75,72.02 | v39.12,65.77 39.12,60.02 v37.5,58.39
A5  (via drill 0.2)
  Top 0.127: v68.5,44.02 69.75,44.02 U$1.P66 | v72.12,38.14 72.12,35.89 v72.88,35.14 | v75.5,23.14 v74.25,24.39
  Bottom 0.127: v68.5,44.02 68.5,42.64 71.25,39.89 71.25,38.77 71.88,38.14 v72.12,38.14 | v72.88,35.14 72.88,32.27 72,31.39 72,30.64 74.25,28.39 v74.25,24.39 | v75.5,23.14 75.5,8.14 73.75,6.39 73.75,3.89 21B.1
A5'  (via drill 0.2)
  Top 0.127: v24.25,28.02 25.88,29.64 25.88,31.52 U3.4 | v18.62,27.64 16.12,27.64 12,31.77 10.75,31.77 v9.12,33.39 | v28.5,64.77 v26.88,64.77 | v29.25,60.52 29.25,62.14 U2.7 | v56.5,52.27 56.5,49.52 U$1.P95 | v53.62,57.02 v53.62,55.89
  Bottom 0.127: v24.25,28.02 21.88,25.64 21.38,25.64 19.38,27.64 v18.62,27.64 | v9.12,33.39 9.12,50.52 9.38,50.77 9.38,55.39 8.75,56.02 8.75,58.89 12.25,62.39 12.25,67.64 15.5,70.89 21.62,70.89 23.62,68.89 | 23.62,68.89 26.38,66.14 26.38,65.27 v26.88,64.77 | v28.5,64.77 28.5,64.52 29.25,63.77 v29.25,60.52 | v56.5,52.27 56,52.27 53.62,54.64 v53.62,55.89 | v53.62,57.02 43,67.64 41.25,67.64 40.62,68.27 40.12,68.27 39.5,67.64 37.75,67.64 36.5,68.89 23.62,68.89
A6  (via drill 0.2)
  Top 0.127: v60.5,15.27 64,18.77 | 64,18.77 68.38,23.14 68.38,28.02 68,28.39 68,30.52 69,31.52 69.75,31.52 U$1.P41 | v58.25,15.27 51,8.02 50,8.02 48.38,6.39 48.38,3.89 11A.1 | v71.12,8.39 71.12,9.02 72.25,10.14 v72.25,10.27 | 64,18.77 v64.12,18.77
  Bottom 0.127: v58.25,15.27 v60.5,15.27 | v71.12,8.39 71.12,3.89 20B.1 | v72.25,10.27 72.25,10.64 v64.12,18.77
A6'  (via drill 0.2)
  Top 0.127: v26.38,33.27 26.38,31.64 U3.5 | v20.75,41.39 v21.5,40.64 | v21.12,53.89 20.62,54.39 20.62,61.64 v20.75,61.77 | v27.38,63.77 27.38,63.39 27.75,63.02 27.75,62.27 U2.6 27.88,62.14 27.88,61.14 30.25,58.77 v30.25,58.39 | v51.88,47.02 53.38,47.02 54.38,48.02 54.38,49.39 U$1.P99 | v48,48.27 46.62,48.27 v45.75,47.39 | v43,51.89 41.88,51.89 38.38,55.39 v33.25,55.39
  Bottom 0.127: v26.38,33.27 26.38,35.77 v21.5,40.64 | v20.75,41.39 20.75,44.77 21.25,45.27 21.25,53.77 v21.12,53.89 | v20.75,61.77 25.38,61.77 v27.38,63.77 | v51.88,47.02 49.25,47.02 v48,48.27 | v45.75,47.39 44,49.14 44,50.89 v43,51.89 | v33.25,55.39 33.25,56.52 31.25,58.52 30.38,58.52 v30.25,58.39
A7  (via drill 0.2)
  Top 0.127: v77.75,35.64 71.75,41.64 71.75,41.89 71.5,42.14 69.88,42.14 U$1.P62 | v77.75,10.27 76.38,8.89 v71.75,8.89
  Bottom 0.127: v77.75,35.64 77.75,32.14 78.38,31.52 78.38,10.89 v77.75,10.27 | v71.75,8.89 70.88,8.89 68.62,6.64 68.62,3.89 19B.1
A7'  (via drill 0.2)
  Top 0.127: v35.5,41.77 35.5,41.52 37.62,39.39 38.12,39.39 U3.38 | v29.62,49.02 29.62,50.39 29.5,50.52 29.5,51.02 30.5,52.02 v31,52.02 | 31,55.89 31,56.39 v31.12,56.52 | 31,55.89 v31,53.14 | v29.25,58.39 29.25,58.89 28.25,59.89 28.12,59.89 26.62,61.39 26.62,62.14 U2.5 | v53.38,50.77 53.38,49.52 U$1.P101 | v50.75,53.39 45.75,53.39 44.25,54.89 40.25,54.89 v39.25,55.89 | 31,55.89 v37.5,55.89
  Bottom 0.127: v35.5,41.77 35.5,42.52 29.62,48.39 v29.62,49.02 | v31,53.14 v31,52.02 | v29.25,58.39 v31.12,56.52 | v50.75,53.39 v53.38,50.77 | v37.5,55.89 v39.25,55.89
A8  (via drill 0.2)
  Top 0.127: v76.38,33.14 76.38,36.64 72,41.02 69.88,41.02 U$1.P60 | v70.5,14.64 v77.25,21.39 | v67.62,13.27 v70.5,13.27 | v67.62,8.27 v67.62,10.27
  Bottom 0.127: v76.38,33.14 77.75,31.77 77.75,25.89 77.25,25.39 v77.25,21.39 | v70.5,13.27 v70.5,14.64 | v67.62,10.27 v67.62,13.27 | v67.62,8.27 67.62,5.39 66.12,3.89 18B.1
A8'  (via drill 0.2)
  Top 0.127: v39.75,39.89 38.25,39.89 U3.39 | v42.25,41.14 42.25,44.39 44.62,46.77 44.62,47.14 47.75,50.27 47.75,51.27 48.25,51.77 53.5,51.77 54.12,51.14 | 54.12,51.14 54.88,50.39 54.88,49.52 U$1.P98 | v27.88,76.89 27.88,75.27 U2.27 | v53.38,76.89 53.88,76.89 61,69.77 61.62,69.77 63.38,68.02 63.38,66.39 64.12,65.64 66.5,65.64 67.12,65.02 67.12,60.89 64.5,58.27 v64.5,57.27 | v62.38,56.89 61.62,56.89 59.88,55.14 58.5,55.14 v57.5,54.14 | v55.75,53.89 55.75,52.64 54.25,51.14 54.12,51.14
  Bottom 0.127: v39.75,39.89 41,39.89 v42.25,41.14 | v53.38,76.89 v27.88,76.89 | v64.5,57.27 63.88,57.27 63.5,56.89 v62.38,56.89 | v57.5,54.14 56,54.14 v55.75,53.89
A9  (via drill 0.2)
  Top 0.127: v68.12,40.52 69.75,40.52 U$1.P59 | v63.88,8.27 v63.88,10.89
  Bottom 0.127: v68.12,40.52 65.88,40.52 64.5,39.14 64.5,31.14 63.38,30.02 63.38,29.14 63.5,29.02 63.5,28.52 63.25,28.27 62.75,28.27 62,29.02 62,31.64 61.75,31.89 61.25,31.89 61,31.64 61,26.77 60,25.77 60,21.27 66.12,15.14 66.12,13.14 v63.88,10.89 | v63.88,8.27 63.88,4.27 63.5,3.89 17B.1
A9'  (via drill 0.2)
  Top 0.127: v42.12,38.27 40,40.39 38.25,40.39 U3.40 | U$1.P97 55.5,49.52 55.5,50.27 v56,50.77 56,52.52 56.38,52.89 56.38,55.39 54.62,57.14 54.62,59.27 v52.62,61.27 | v31,71.02 29.25,72.77 29.25,75.14 U2.26
  Bottom 0.127: v42.12,38.27 45.12,38.27 45.38,38.02 48.12,38.02 53.62,43.52 57.75,43.52 58.12,43.89 58.12,47.14 57.12,48.14 57.12,49.64 v56,50.77 | v31,71.02 35.5,71.02 36,70.52 41.62,70.52 45.5,66.64 50,66.64 50.12,66.77 50.62,66.77 52.62,64.77 v52.62,61.27
A10  (via drill 0.2)
  Top 0.127: v75.12,36.39 72,39.52 69.88,39.52 U$1.P57 | v73,26.64 v75.12,28.77
  Bottom 0.127: v75.12,28.77 v75.12,36.39 | v73,26.64 73,10.27 72.5,9.77 65.38,9.77 64.38,8.77 63.25,8.77 61,6.52 61,3.89 16B.1
A10'  (via drill 0.2)
  Top 0.127: v46.25,35.14 45,36.39 44.75,36.39 40.38,40.77 38.25,40.77 U3.41 | v49.75,34.77 51.62,34.77 55.62,38.77 55.62,40.14 57,41.52 57,45.89 56.75,46.14 56.75,46.64 56.88,46.77 | 56.88,46.77 57.62,47.52 59.75,47.52 60.38,48.14 60.38,49.39 U$1.P87 | v36.25,71.02 33,74.27 33,75.14 U2.23 | v50,67.27 50,66.64 49.88,66.52 49.88,63.39 48.5,62.02 48.5,58.39 v51,55.89 | 56.88,46.77 v56.62,47.02
  Bottom 0.127: v46.25,35.14 49.38,35.14 v49.75,34.77 | v36.25,71.02 41.5,71.02 45.5,67.02 49.75,67.02 v50,67.27 | v51,55.89 51,53.89 56.38,48.52 56.38,47.27 v56.62,47.02
A11  (via drill 0.2)
  Top 0.127: v68.5,38.52 69.75,38.52 U$1.P55 | v81.24,32.76 81.24,32.66 70.44,21.86 70.44,20.71 v58.75,9.02
  Bottom 0.127: v68.5,38.52 69.5,38.52 71.25,36.77 72,36.77 75.5,40.27 76.52,40.27 81.64,35.14 81.64,33.16 v81.24,32.76 | v58.75,9.02 58.75,4.14 15B.1
A11'  (via drill 0.2)
  Top 0.127: v43.5,39.52 42.38,39.52 40.62,41.27 38.25,41.27 U3.42 | v42.38,49.14 v44.75,49.14 | v36.25,68.39 36.25,68.89 30.5,74.64 30.5,75.14 U2.25 | v55.62,63.52 55.62,57.02 57,55.64 57,52.02 56.88,51.89 56.88,49.52 U$1.P94 | v53.25,71.89 49,71.89 47.25,73.64 45.62,73.64 40.38,68.39 v40.38,67.77
  Bottom 0.127: v43.5,39.52 44,39.02 46.62,39.02 49.5,41.89 49.5,44.39 v44.75,49.14 | v42.38,49.14 42.38,49.52 37,54.89 37,55.89 36.38,56.52 36.38,58.14 37.88,59.64 37.88,65.27 | 37.88,65.27 37.88,66.77 v36.25,68.39 | v55.62,63.52 53.38,65.77 53.38,69.39 52.38,70.39 52.38,71.02 v53.25,71.89 | 37.88,65.27 v40.38,67.77
A12  (via drill 0.2)
  Top 0.127: v67.62,35.77 67.88,36.02 69.75,36.02 U$1.P50 | v72.5,21.14 66.62,15.27 65.38,15.27 62.38,12.27 62.38,11.52 59.12,8.27 v57.88,8.27
  Bottom 0.127: v67.62,35.77 68.5,34.89 68.62,34.89 70.75,32.77 70.75,29.39 71.62,28.52 72,28.52 72.5,28.02 v72.5,21.14 | v57.88,8.27 56,6.39 56,3.89 14B.1
A12'  (via drill 0.2)
  Top 0.127: v36.25,41.77 38.12,41.77 U3.43 | v30.62,48.89 30.62,50.89 v32.75,53.02 | v25.62,60.52 25.62,61.89 25.38,62.14 U2.4 | v50.38,51.27 51.25,51.27 51.88,50.64 51.88,49.52 U$1.P104 | v44.62,55.64 v46.38,53.89 | v39.88,57.89 v42.38,57.89 | v36.88,56.77 33,56.77 v32.62,56.39
  Bottom 0.127: v36.25,41.77 36.25,42.14 33.25,45.14 33.25,46.27 v30.62,48.89 | 31,54.77 25.62,60.14 v25.62,60.52 | 31,54.77 v32.75,53.02 | v50.38,51.27 49.12,50.02 48.5,50.02 46.38,52.14 v46.38,53.89 | v42.38,57.89 v44.62,55.64 | v39.88,57.89 38,57.89 v36.88,56.77 | 31,54.77 v32.62,56.39
A13  (via drill 0.2)
  Top 0.127: v68.38,34.02 68.88,34.52 69.75,34.52 U$1.P47 | v68.38,22.02 54.62,8.27 v54.62,5.14
  Bottom 0.127: v68.38,22.02 v68.38,34.02 | v54.62,5.14 53.38,3.89 13B.1
A13'  (via drill 0.2)
  Top 0.127: v45.62,38.52 45.62,38.89 44.5,40.02 42.25,40.02 40,42.27 38.25,42.27 U3.44 | v55.12,46.14 v55.12,44.27 | v53.62,48.02 53.62,48.27 53.88,48.52 53.88,49.39 U$1.P100 | v29.5,71.77 26.62,74.64 26.62,75.14 U2.28 | v49.62,73.52 52.5,73.52 v55,71.02 | v58.88,67.14 59.25,67.14 59.38,67.27 62,67.27 64,65.27 66.5,65.27 66.75,65.02 66.75,62.52 v64,59.77 | v62.88,58.64 63.25,58.27 63.25,55.14 v62.62,54.52 | v62,45.52 62,46.39 v61.88,46.52 | v60.25,44.89 60.25,44.52 59.75,44.02 v57.5,44.02
  Bottom 0.127: v45.62,38.52 48.25,38.52 53.75,44.02 | 53.75,44.02 54,44.27 v55.12,44.27 | v55.12,46.14 53.62,47.64 v53.62,48.02 | v29.5,71.77 29.75,71.77 31.62,73.64 49.5,73.64 v49.62,73.52 | v58.88,67.14 v55,71.02 | v62.88,58.64 v64,59.77 | v62.62,54.52 62.62,54.14 65.12,51.64 65.12,47.14 63.5,45.52 v62,45.52 | v60.25,44.89 v61.88,46.52 | 53.75,44.02 v57.5,44.02
A14  (via drill 0.2)
  Top 0.127: v66.5,29.39 66.5,32.02 68,33.52 69.75,33.52 U$1.P45 | v63.25,25.39 63.25,24.02 v63.5,23.77 | v64.88,22.39 64.88,22.02 59.62,16.77 59.62,15.02 v52.12,7.52
  Bottom 0.127: v66.5,29.39 63.25,26.14 v63.25,25.39 | v64.88,22.39 v63.5,23.77 | v52.12,7.52 52.12,5.14 50.88,3.89 12B.1
A14'  (via drill 0.2)
  Top 0.127: v41,42.89 38.25,42.89 U3.45 | v42.88,43.14 42.88,44.14 44.75,46.02 45.12,46.02 | 45.12,46.02 47.62,46.02 U$1.P111 | v41.75,52.77 41.62,52.77 36.88,57.52 30.38,57.52 29.75,58.14 29.75,58.77 28.25,60.27 28.12,60.27 27.38,61.02 27.38,63.02 26.88,63.52 26.25,63.52 26.12,63.39 26.12,60.27 25.88,60.02 24,60.02 23.75,60.27 23.75,60.77 24,61.02 24,62.14 U2.3 | 45.12,46.02 v45.12,46.77
  Bottom 0.127: v41,42.89 42.62,42.89 v42.88,43.14 | v41.75,52.77 41.75,52.39 43.62,50.52 43.62,48.27 v45.12,46.77
A15  (via drill 0.2)
  Top 0.127: v67.38,31.77 68.12,32.52 69.75,32.52 U$1.P43 | v60.88,22.89 59.5,22.89 53,16.39 53,16.02 v51.12,14.14
  Bottom 0.127: v67.38,31.77 67.12,31.77 61.5,26.14 61.12,26.14 60.88,25.89 v60.88,22.89 | v51.12,14.14 50.75,14.14 50,13.39 50,8.02 48.38,6.39 48.38,3.89 11B.1
A15'  (via drill 0.2)
  Top 0.127: v41,44.14 40.25,43.39 38.25,43.39 U3.46 | v43.62,44.14 44.62,44.14 46,45.52 47.62,45.52 U$1.P112 | v25.75,68.27 22.88,71.14 22.88,75.14 U2.31
  Bottom 0.127: 43.5,44.14 v41,44.14 | v25.75,68.27 34.12,59.89 34.12,54.39 37.5,51.02 38.62,51.02 40.12,49.52 40.12,47.52 43.5,44.14 | 43.5,44.14 v43.62,44.14
A16'  (via drill 0.2)
  Top 0.127: v30.88,44.27 38.12,44.27 U3.48 38.25,44.39 v39.38,44.39 | v22.88,60.52 22.88,62.14 U2.2 | v45.88,44.64 47.62,44.64 U$1.P114 | v43.25,46.89 40.25,46.89 v39.38,46.02
  Bottom 0.127: v30.88,44.27 29.75,44.27 29.5,44.02 25.75,44.02 23.88,45.89 23.88,59.52 v22.88,60.52 | v45.88,44.64 45.5,44.64 v43.25,46.89 | v39.38,44.39 v39.38,46.02
A17'  (via drill 0.2)
  Top 0.127: v36.62,53.14 36.5,53.02 36.5,47.14 U3.51 | v30.88,69.39 v34.88,65.39 | v24.62,73.52 24.62,74.64 24.12,75.14 U2.30 24.12,75.27 24.12,80.14 26,82.02 26,85.14 v30.12,89.27 | v71.25,41.64 69.88,41.64 U$1.P61 | v77.32,43.81 77.32,46.46 v77.5,46.64 | v77.5,48.14 77.5,48.39 79.88,50.77 79.88,55.39 v77.25,58.02 | v78.25,87.64 v78.25,59.02
  Bottom 0.127: v36.62,53.14 36.62,55.89 36,56.52 36,59.77 34.88,60.89 v34.88,65.39 | v30.88,69.39 29.75,69.39 29,70.14 28,70.14 v24.62,73.52 | v71.25,41.64 72.62,41.64 74,43.02 76.52,43.02 v77.32,43.81 | v77.5,48.14 v77.5,46.64 | v78.25,59.02 v77.25,58.02 | v78.25,87.64 75.5,90.39 31.25,90.39 v30.12,89.27
A18'  (via drill 0.2)
  Top 0.127: v36.38,45.27 36,45.64 36,47.02 U3.52 35.88,47.14 v35.88,49.39 | v44.25,43.64 46.12,43.64 46.5,44.02 47.62,44.02 U$1.P115 | v25.88,57.39 23.12,57.39 21.62,58.89 21.62,62.14 U2.1
  Bottom 0.127: v36.38,45.27 38,43.64 v44.25,43.64 | v25.88,57.39 25.88,56.77 30.5,52.14 30.5,51.77 32.88,49.39 v35.88,49.39
B0  (via drill 0.2)
  Top 0.127: v35.62,45.27 34.5,46.39 34.5,47.02 U3.55 | v45.5,43.02 45.88,43.02 46.38,43.52 47.62,43.52 U$1.P116
  Bottom 0.127: v35.62,45.27 38.5,42.39 44.88,42.39 v45.5,43.02
B1  (via drill 0.2)
  Top 0.127: v34,48.39 34,47.14 U3.56 | v39.25,51.14 v38.25,50.14 | v42.38,48.39 42.38,48.02 v41.75,47.39 | v44.75,43.02 45.25,42.52 45.75,42.52 46.25,43.02 47.62,43.02 U$1.P117
  Bottom 0.127: v34,48.39 36.5,48.39 v38.25,50.14 | v39.25,51.14 39.62,51.14 v42.38,48.39 | v41.75,47.39 41.75,46.89 44.75,43.89 v44.75,43.02
B2  (via drill 0.2)
  Top 0.127: v42.38,51.02 39.75,53.64 36.38,53.64 36.12,53.39 36.12,52.39 33.5,49.77 33.5,47.14 U3.57 | v49,43.14 48.5,42.64 47.75,42.64 U$1.P118
  Bottom 0.127: v42.38,51.02 42.38,49.89 43.25,49.02 43.25,47.89 46,45.14 47,45.14 v49,43.14
B3  (via drill 0.2)
  Top 0.127: v33.75,46.02 33.5,46.02 33,46.52 33,47.02 U3.58 | v46.12,42.14 47.62,42.14 U$1.P119
  Bottom 0.127: v33.75,46.02 33.75,45.02 37.12,41.64 44.88,41.64 45,41.52 45.5,41.52 v46.12,42.14
B4  (via drill 0.2)
  Top 0.127: v34.25,45.27 33.75,45.27 32.5,46.52 32.5,47.02 U3.59 | v45.25,42.02 45.5,42.02 45.88,41.64 47.62,41.64 U$1.P120
  Bottom 0.127: v34.25,45.27 36.5,43.02 36.5,42.89 37.38,42.02 v45.25,42.02
B5  (via drill 0.2)
  Top 0.127: v32,48.27 32,47.14 U3.60 | v40.88,51.77 v38.5,49.39 | v50.75,43.27 49.5,42.02 49.5,41.89 48.75,41.14 47.75,41.14 U$1.P121
  Bottom 0.127: v32,48.27 33.38,48.27 33.75,47.89 37,47.89 v38.5,49.39 | v40.88,51.77 40.88,52.64 41.5,53.27 42.38,53.27 46.25,49.39 46.25,48.02 50.75,43.52 v50.75,43.27
B6  (via drill 0.2)
  Top 0.127: v31.5,45.02 31.5,47.02 U3.61 | v45.38,40.39 46.5,40.39 46.75,40.14 47.62,40.14 U$1.P123
  Bottom 0.127: v31.5,45.02 36.12,40.39 38.5,40.39 39.5,39.39 42.5,39.39 43.5,40.39 v45.38,40.39
B7  (via drill 0.2)
  Top 0.127: v34.38,51.39 31,48.02 31,47.14 U3.62 | v40.62,49.39 v39.5,49.39 | v46,39.89 46.5,39.89 46.75,39.64 47.62,39.64 U$1.P124
  Bottom 0.127: v34.38,51.39 36.75,51.39 37.5,50.64 38.5,50.64 39.5,49.64 v39.5,49.39 | v40.62,49.39 42.75,47.27 42.75,46.52 46.62,42.64 46.62,40.52 v46,39.89
BAT  (via drill 0.2)
  Top 0.127: v33.5,28.02 32,29.52 32,31.52 U3.16 | v35.38,22.14 35.38,18.64 34.62,17.89 31.62,17.89 v31.25,18.27 | v29,21.39 v27.38,21.39 26.62,21.39 26.38,21.64 D3.2
  Bottom 0.127: v33.5,28.02 35.38,26.14 v35.38,22.14 | v31.25,18.27 31.25,19.14 v29,21.39 | v27.38,21.39 26.25,20.27 26.25,17.89 BT1.P
BOOT0  (via drill 0.2)
  Top 0.127: R24.1 22.38,27.52 22.38,28.02 20.88,29.52 R30.2 20.75,29.64 20.38,30.02 v20.38,30.77 | v20.38,34.89 21.75,36.27 22.62,36.27 U3.94
  Bottom 0.127: v20.38,30.77 v20.38,34.89
BRIGHT
  Top 0.127: R35.1 53.38,22.52 54.25,22.52 R34.1 54.38,22.52 55.25,22.52 R33.1 55.38,22.52 56.5,22.52 56.75,22.77 56.75,24.77 55.88,25.64 55.88,26.02 55.75,26.14 55.25,26.14 55,26.39 55,27.14 U$1.P11
CFG_CLK  (via drill 0.2)
  Top 0.127: v44.38,32.64 41.88,35.14 41.25,35.14 40.62,35.77 40.62,36.02 38.88,37.77 38.25,37.77 U3.35 | v52.88,30.64 56.75,30.64 57.88,29.52 57.88,27.27 U$1.P17
  Bottom 0.127: v44.38,32.64 50.88,32.64 v52.88,30.64
CFG_DATA  (via drill 0.2)
  Top 0.127: v26,38.77 22.75,38.77 U3.89 | v34.62,37.64 v33.12,37.64 | v39.5,36.39 41.12,34.77 41.5,34.77 42.88,33.39 v42.88,31.14 | v53.38,30.02 55.38,30.02 56.88,28.52 56.88,27.27 U$1.P15
  Bottom 0.127: v26,38.77 27.12,37.64 v33.12,37.64 | v34.62,37.64 37.38,37.64 38.62,36.39 v39.5,36.39 | v42.88,31.14 44,31.14 44.5,30.64 50.25,30.64 50.88,30.02 v53.38,30.02
CFG_RESET  (via drill 0.2)
  Top 0.127: v44.75,35.89 43.75,35.89 41.38,38.27 38.25,38.27 U3.36 | v57.38,29.27 57.38,27.27 U$1.P16
  Bottom 0.127: v44.75,35.89 45.88,35.89 46,36.02 48.62,36.02 48.75,35.89 50.75,35.89 v57.38,29.27
COMPOSITE
  Top 0.127: 44.25,89.27 40,85.02 X1.10 | 44.25,89.27 45.38,90.39 69.12,90.39 70.38,89.14 70.38,86.27 77.38,79.27 77.38,61.77 75.75,60.14 75.75,57.39 R4.1 | 44.25,89.27 42.75,90.77 14.88,90.77 13.25,89.14 13.25,84.39 9.38,80.52 9.38,78.02 X2.2
CS_LLS  (via drill 0.2)
  Top 0.127: v15.88,49.52 15.88,55.77 R21.2 | v14.12,42.89 12.88,41.64 MICRO_SD1.2
  Bottom 0.127: v15.88,49.52 15.88,46.64 14.12,44.89 v14.12,42.89
CSYNC  (via drill 0.2)
  Top 0.127: v51.62,30.89 54.38,28.14 54.38,27.27 U$1.P10 | v41.38,36.39 41.38,37.14 v40.75,37.77 | v44.75,37.77 45.12,37.77 45.38,38.02 45.88,38.02 46.12,38.27 46.12,38.77 44.25,40.64 42,40.64 41.5,41.14 41.5,45.39 v40.5,46.39 | v38.38,48.52 38.38,48.77 37,50.14 v37,52.27 | v34.38,64.77 35,64.77 35.38,65.14 35.38,68.14 31.88,71.64 31.88,72.39 30.38,73.89 30,73.89 29.88,74.02 29.88,76.39 30,76.52 33.25,76.52 33.75,76.02 33.75,74.02 33.88,73.89 35.88,73.89 36.25,74.27 36.25,82.39 38.75,84.89 v38.75,89.27 | v70.75,71.89 70.75,70.27 69.88,69.39 U1.16
  Bottom 0.127: v51.62,30.89 50.38,30.89 49.12,32.14 36.38,32.14 34.88,33.64 34.88,34.14 36.62,35.89 40.88,35.89 v41.38,36.39 | v44.75,37.77 v40.75,37.77 | v38.38,48.52 v40.5,46.39 | v37,52.27 36.75,52.27 34.5,54.52 34.5,64.64 v34.38,64.77 | v38.75,89.27 58.38,89.27 65.75,81.89 75.75,81.89 79.62,78.02 79.62,77.52 77,74.89 74.25,74.89 72.88,73.52 72.38,73.52 v70.75,71.89
CTRL_CLK  (via drill 0.2)
  Top 0.127: v19.38,36.64 21,38.27 22.62,38.27 U3.90 | v18.62,20.02 v14.62,24.02 | v34.38,22.64 34.75,22.64 35.88,23.77 41.5,23.77 v46.62,28.89 | v51.62,29.39 52.38,28.64 52.38,27.27 U$1.P6
  Bottom 0.127: v19.38,36.64 19.38,36.27 14.62,31.52 v14.62,24.02 | v18.62,20.02 19.62,20.02 24.62,15.02 28.75,15.02 34.38,20.64 v34.38,22.64 | v46.62,28.89 51.12,28.89 v51.62,29.39
D0  (via drill 0.2)
  Top 0.127: v57.75,25.77 58.04,25.77 58.43,25.38 59.86,25.38 60.88,26.39 60.88,27.14 U$1.P23 | v38,16.02 v43.62,21.64 | 31.75,6.39 31.75,5.14 30.5,3.89 4A.1 | 31.75,6.39 v31.75,8.14 | v36.25,63.77 36.75,63.27 36.75,62.27 U2.13 | v29.25,68.39 29.25,69.02 v28.88,69.39 | v6.25,59.52 6.25,55.64 8.75,53.14 v8.75,50.89 | 31.75,6.39 v29.75,8.39
  Bottom 0.127: v57.75,25.77 57.25,25.27 51.38,25.27 47.75,21.64 v43.62,21.64 | v38,16.02 38,14.39 v31.75,8.14 | v36.25,63.77 36.25,64.77 32.5,68.52 29.38,68.52 v29.25,68.39 | v28.88,69.39 23.5,69.39 21.62,71.27 14.62,71.27 11,67.64 8.75,67.64 6.25,65.14 v6.25,59.52 | v8.75,50.89 8.75,33.77 8.62,33.64 8.62,23.64 10.5,21.77 10.5,16.39 12.12,14.77 23.25,14.77 28.62,9.39 29,9.39 29.75,8.64 v29.75,8.39
D1  (via drill 0.2)
  Top 0.127: v62.5,29.39 62.5,27.27 U$1.P26 | v60.88,37.89 v60.88,39.27 61.38,39.77 61.38,41.14 61.12,41.39 60.62,41.39 60.38,41.14 60.38,40.77 53.25,33.64 v53.25,32.64 | v54.25,54.77 52.75,54.77 52.62,54.64 47.25,54.64 44.5,57.39 44.5,59.64 44.12,60.02 41,60.02 39.75,61.27 39.75,63.39 39.62,63.52 39,63.52 38.12,62.64 38.12,62.27 U2.14 | v33.12,8.77 33.12,3.89 5A.1 | v42,17.64 42,19.27 v47.62,24.89
  Bottom 0.127: v62.5,29.39 62.5,36.27 v60.88,37.89 | v60.88,39.27 58.5,41.64 58.5,47.14 57.88,47.77 57.88,51.77 56.25,53.39 55.5,53.39 54.25,54.64 v54.25,54.77 | v42,17.64 v33.12,8.77 | v47.62,24.89 48.75,24.89 53.38,29.52 53.62,29.52 53.88,29.77 53.88,31.27 53.25,31.89 v53.25,32.64
D2  (via drill 0.2)
  Top 0.127: v63,28.77 63,27.27 U$1.P27 | v59.5,44.52 59.12,44.52 v57.25,46.39 | v49.38,54.02 47.25,54.02 42.75,58.52 42.12,58.52 39.38,61.27 39.38,62.14 U2.15 | v35.62,9.39 35.62,3.89 6A.1 | v44.12,17.89 44.12,19.89 v48.62,24.39 | v54.75,32.64 v54,31.89 | v54.75,33.89 54.75,34.52 60,39.77 60,40.02 v60.88,40.89
  Bottom 0.127: v63,28.77 63,36.52 64.12,37.64 64.12,38.14 61.12,41.14 | 61.12,41.14 60.5,41.77 60.12,41.77 59.5,42.39 v59.5,44.52 | v57.25,46.39 56.5,46.39 50.12,52.77 50.12,53.27 v49.38,54.02 | v44.12,17.89 v35.62,9.39 | v48.62,24.39 52.88,28.64 54.62,28.64 54.88,28.89 54.88,31.39 54.38,31.89 v54,31.89 | v54.75,33.89 v54.75,32.64 | 61.12,41.14 v60.88,40.89
D3  (via drill 0.2)
  Top 0.127: v66.5,28.64 66.5,27.27 U$1.P34 | v61.12,16.77 v63.38,19.02 | v57.25,16.77 56.88,16.77 50.62,10.52 48.62,10.52 46.12,8.02 45,8.02 43.25,6.27 43.25,3.89 9A.1 | v76.88,72.27 75.5,72.27 74.5,73.27 74.5,80.77 73.38,81.89 68,81.89 62.75,87.14 43.25,87.14 42.5,86.39 42.5,84.77 40.62,82.89 40.62,75.27 U2.17 | v79.62,42.64 79.62,36.39 v79.38,36.14 | v79.25,25.89 76,22.64 v72,22.64
  Bottom 0.127: v66.5,28.64 66.5,27.89 62.5,23.89 | 62.5,23.89 62,23.39 62,20.39 v63.38,19.02 | v57.25,16.77 v61.12,16.77 | v76.88,72.27 76.88,71.89 81.5,67.27 81.5,54.27 78.88,51.64 78.88,43.39 v79.62,42.64 | v79.38,36.14 79.38,35.89 79.12,35.64 79.12,26.02 v79.25,25.89 | v72,22.64 70.5,22.64 67.75,19.89 66.5,19.89 62.5,23.89
D4  (via drill 0.2)
  Top 0.127: 70,25.52 70,21.02 v58,9.02 | 70,25.52 70,27.14 68.75,28.39 68.75,30.27 69,30.52 69.75,30.52 U$1.P39 | v50.5,9.02 48.5,9.02 45.75,6.27 45.75,3.89 10A.1 | v36.75,81.77 36.75,78.39 39.25,75.89 39.25,75.27 U2.18 | v32.62,82.39 33,82.39 34.38,83.77 34.38,86.27 v30.38,90.27 | v79.62,87.02 79.62,56.14 v81,54.77 | v82.14,35.84 81.39,35.84 78.75,33.2 78.75,32.27 77.12,30.64 75.12,30.64 70,25.52